# Altium project sensorbox_kbd.PrjPCB
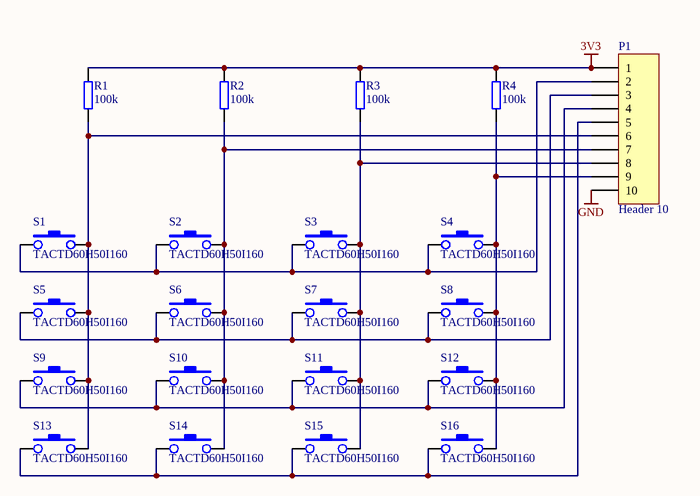
[diagram p0: sensorbox_kbd.SchDoc]
1 sheet, 21 parts. Net scope: global (net labels, ports and power ports of the same name join across sheets).
Board file: sensorbox_kbd.PcbDoc

## Sheet sensorbox_kbd.SchDoc
size A4

### Parts
P1  Header 10  [HDR1X10]
R1  100k  [0603R]
R2  100k  [0603R]
R3  100k  [0603R]
R4  100k  [0603R]
S1  TACTD60H50I160  [TACTD60H50I160]
S2  TACTD60H50I160  [TACTD60H50I160]
S3  TACTD60H50I160  [TACTD60H50I160]
S4  TACTD60H50I160  [TACTD60H50I160]
S5  TACTD60H50I160  [TACTD60H50I160]
S6  TACTD60H50I160  [TACTD60H50I160]
S7  TACTD60H50I160  [TACTD60H50I160]
S8  TACTD60H50I160  [TACTD60H50I160]
S9  TACTD60H50I160  [TACTD60H50I160]
S10  TACTD60H50I160  [TACTD60H50I160]
S11  TACTD60H50I160  [TACTD60H50I160]
S12  TACTD60H50I160  [TACTD60H50I160]
S13  TACTD60H50I160  [TACTD60H50I160]
S14  TACTD60H50I160  [TACTD60H50I160]
S15  TACTD60H50I160  [TACTD60H50I160]
S16  TACTD60H50I160  [TACTD60H50I160]

### Nets
3V3: P1.1 R1.2 R2.2 R3.2 R4.2
GND: P1.10
NetP1_2: P1.2 S1.1 S2.1 S3.1 S4.1
NetP1_3: P1.3 S5.1 S6.1 S7.1 S8.1
NetP1_4: P1.4 S9.1 S10.1 S11.1 S12.1
NetP1_5: P1.5 S13.1 S14.1 S15.1 S16.1
NetP1_6: P1.6 R1.1 S1.2 S5.2 S9.2 S13.2
NetP1_7: P1.7 R2.1 S2.2 S6.2 S10.2 S14.2
NetP1_8: P1.8 R3.1 S3.2 S7.2 S11.2 S15.2
NetP1_9: P1.9 R4.1 S4.2 S8.2 S12.2 S16.2

### Library data of the parts
P1 = Header 10: Header, 10-Pin; LatestRevisionDate: 17-Jul-2002; LatestRevisionNote: Re-released for DXP Platform.; Publisher: Altium Limited
R1-R4 = RES_0603: SMD Resistor
S1-S16 = SW-PB_SMD_5mm: Push button 5mm